# Altium project VL53L0x.PrjPcb
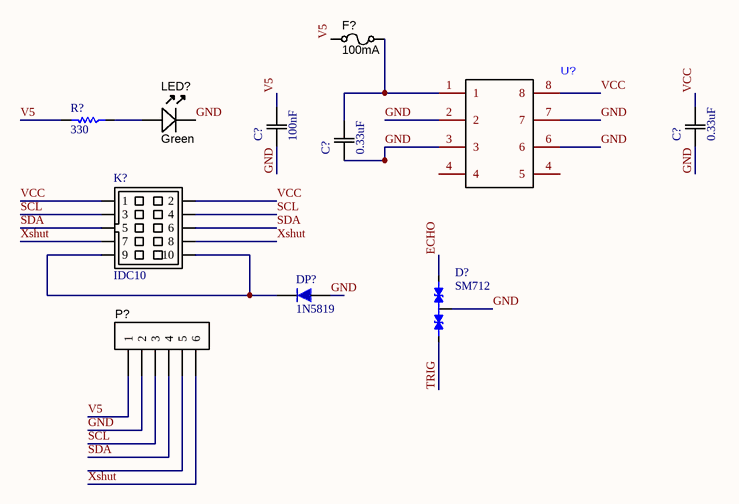
[diagram p0: Sheet1___VL53L0X.SchDoc]
1 sheet, 11 parts. Net scope: global (net labels, ports and power ports of the same name join across sheets).
Board file: PCB_VL53L0X.PcbDoc

## Sheet Sheet1___VL53L0X.SchDoc
size B

### Parts
78L05  (no value)  [78L05CD15V5V_LIB]
C1  100nF  [0805]
C2  0.33uF  [0805]
C3  0.33uF  [0805]
D1  SM712  [psm712]
DP1  1N5819  [430X270D]
F1  value 100mA  [RESC3216X70N]  (hidden comment: Slow-blow)
K1  IDC10  [IDC10-B]
LED1  Color: Green  [LED-0805-K]
P1  Header 6pin  [HDR1X6]  (value not drawn)  (no BOM)
R1  330  [RES 0805 (2012X06L)]

### Nets
ECHO: D1.1
GND: 78L05.2 78L05.3 78L05.6 78L05.7 C1.1(C1) C2.1(C1) C3.1(C1) D1.3 DP1.1 LED1.K P1.2
SCL: K1.3 K1.4 P1.3
SDA: K1.5 K1.6 P1.4
TRIG: D1.2
V5: C1.2(C2) F1.2 P1.1 R1.2
VCC: 78L05.8 C2.2(C2) K1.1 K1.2
Xshut: K1.7 K1.8 P1.6
Net78L05_1: 78L05.1 C3.2(C2) F1.1
NetDP1_2: DP1.2 K1.9 K1.10
NetLED1_A: LED1.A R1.1

Not connected (* = marked no-connect by the designer): 78L05 4; P1 5

### Library data of the parts
78L05 = MC78L05ACDG 5V Regulator
C1-C3 = CAP 470nF 50V: CAP CER 0.1UF 50V X7R 0805; Value: 470nF; Tolerance: 10%
D1 = SM712.TC: Asymmetrical TVS Diode for  Extended Common-Mode RS-485; Manufacturer: SEMTECH
DP1 = 1N5819: Schottkey Rectifiers; Designer: Abbas Basereh
F1 = FUSE_160mA_1206: Fuse 160mA 63VDC 1206 SMD; Manufacturer 1: Holly Fuse; Manufacturer Part Number 1: 12T-0160L; Ratings: 160mA; 63VDC; slow-blow; SCDType: spec
K1 = IDC10: BOXHEADER 10 PIN; Manufacturer: Assmann Electronics Inc; Manufacturer Part Number: AWHW10G-0202-T-R; Connector Type: Header, Shrouded; Number of Positions: 10; Number of Positions Loaded: All; Pitch: 0.100" (2.54mm)
LED1 = LED_SMD_Green_0805_6mcd: LED, 0805 SMD, Green; Manufacturer 1: LITE-ON; Manufacturer Part Number 1: LTST-C171GKT; Material: GaP; Ratings: 6 mcd; 569 nm; SCDType: source
P1 = Header6P: Header, 6-pin
R1 = Resistor: Tolerance: 5%; Power: 1/8 W